# EAGLE design Adafruit FONA SIM5320 3G Breakout (EAGLE 9.1.0)
COMPANY: ADAFRUIT INDUSTRIES; DRAWN: KTOWN; REV: A
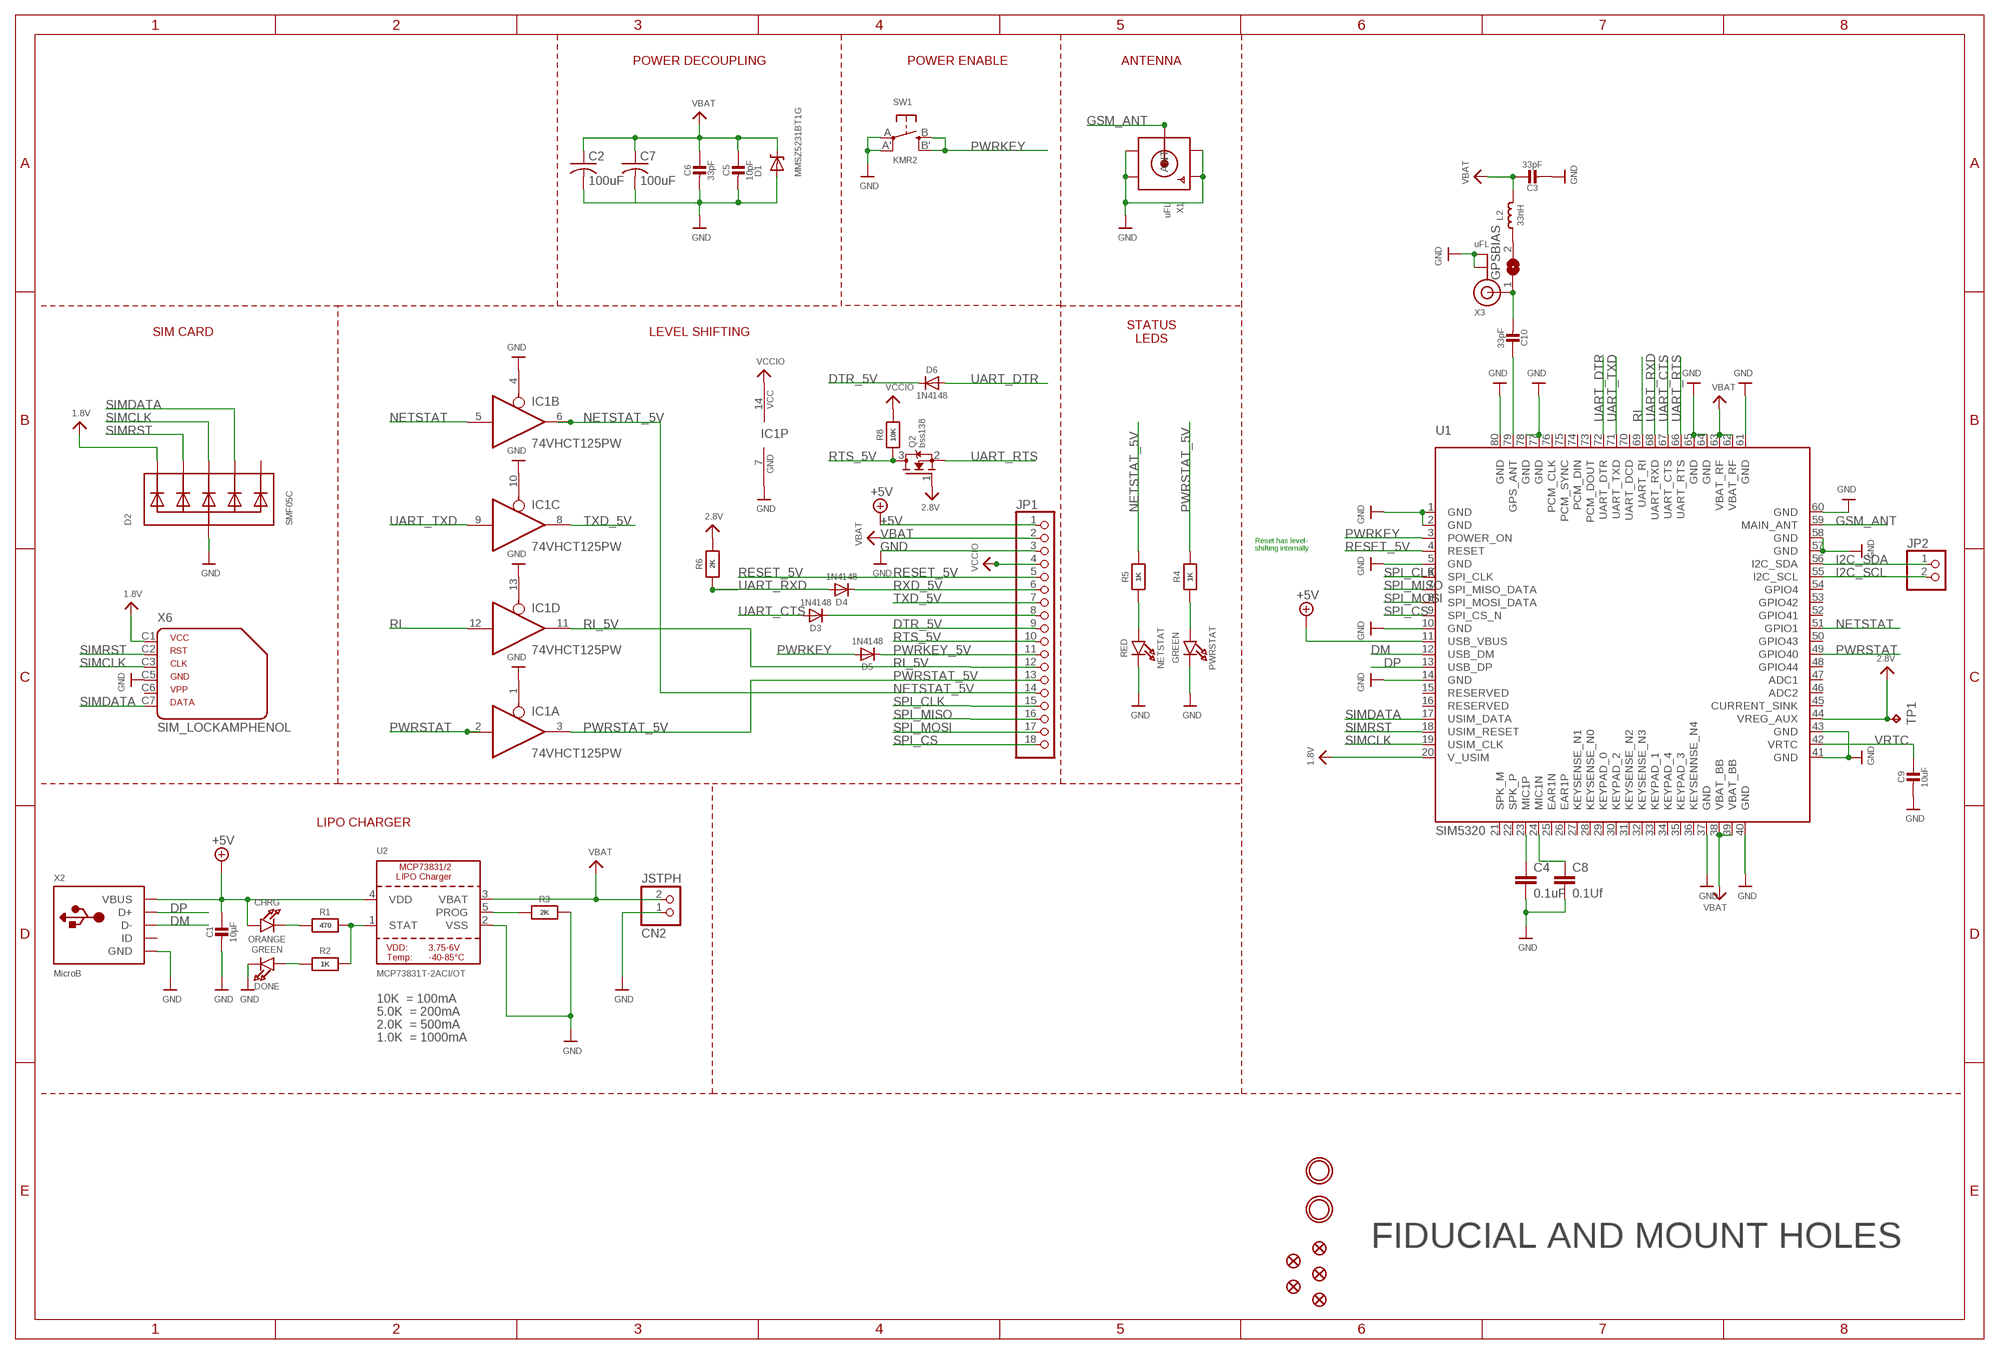
[diagram p0: schematic, sheet 1]

## Parts
C1  10µF  CAP_CERAMIC0805-NOOUTLINE  [0805-NO]
C2  100uF  C-USC1210  [C1210]
C3  33pF  CAP_CERAMIC0805-NOOUTLINE  [0805-NO]
C4  0.1uF  C-EUC1210  [C1210]
C5  10pF  CAP_CERAMIC0805-NOOUTLINE  [0805-NO]
C6  33pF  CAP_CERAMIC0805-NOOUTLINE  [0805-NO]
C7  100uF  C-USC1210  [C1210]
C8  0.1Uf  C-EUC1210  [C1210]
C9  10uF  CAP_CERAMIC0805-NOOUTLINE  [0805-NO]
C10  33pF  CAP_CERAMIC0805-NOOUTLINE  [0805-NO]
CHRG  ORANGE  LED0805_NOOUTLINE  [CHIPLED_0805_NOOUTLINE]
CN2  JSTPH  JST_2PIN  [JSTPH2]
D1  MMSZ5231BT1G  DIODE-ZENERSOD123  [SOD-123]
D2  SMF05C  TVSARRAY_5LANE  [SOT363]
D3  1N4148  DIODESOD-323  [SOD-323]
D4  1N4148  DIODESOD-323  [SOD-323]
D5  1N4148  DIODESOD-323  [SOD-323]
D6  1N4148  DIODESOD-323  [SOD-323]
DONE  GREEN  LED0805_NOOUTLINE  [CHIPLED_0805_NOOUTLINE]
FID1  FIDUCIAL""  [FIDUCIAL_1MM]
FID2  FIDUCIAL""  [FIDUCIAL_1MM]
FID3  FIDUCIAL""  [FIDUCIAL_1MM]
FID4  FIDUCIAL""  [FIDUCIAL_1MM]
FID5  FIDUCIAL""  [FIDUCIAL_1MM]
GPSBIAS  SOLDERJUMPER  [SOLDERJUMPER_ARROW_NOPASTE]
IC1  74VHCT125PW  74ABT125PW  [TSSOP14]
JP1  HEADER-1X18  [1X18_ROUND70]
JP2  HEADER-1X2ROUND  [1X02_ROUND]
L2  33nH  INDUCTOR_0805MP  [_0805MP]
NETSTAT  RED  LED0805_NOOUTLINE  [CHIPLED_0805_NOOUTLINE]
PWRSTAT  GREEN  LED0805_NOOUTLINE  [CHIPLED_0805_NOOUTLINE]
Q2  bss138  MOSFET-NWIDE  [SOT23-WIDE]
R1  470  RESISTOR0805_NOOUTLINE  [0805-NO]
R2  1K  RESISTOR0805_NOOUTLINE  [0805-NO]
R3  2K  RESISTOR0805_NOOUTLINE  [0805-NO]
R4  1K  RESISTOR0805_NOOUTLINE  [0805-NO]
R5  1K  RESISTOR0805_NOOUTLINE  [0805-NO]
R6  2K  RESISTOR0805_NOOUTLINE  [0805-NO]
R8  10K  RESISTOR0805_NOOUTLINE  [0805-NO]
SW1  KMR2  SWITCH_TACT_SMT4.6X2.8  [BTN_KMR2_4.6X2.8]
TP1  TPTP11R  [TP11R]
U1  SIM5320  GSM_SIM5320_LITERAL  [SIM5320]
U2  MCP73831T-2ACI/OT  MCP73831/2  [SOT23-5]
U$33  MOUNTINGHOLE2.5  [MOUNTINGHOLE_2.5_PLATED]
U$34  MOUNTINGHOLE2.5  [MOUNTINGHOLE_2.5_PLATED]
X1  uFL  SMACONNECTOR_EDGE_UFL  [SMA_EDGELAUNCH_UFL]
X2  MicroB  USBMICRO_20329  [4UCONN_20329]
X3  uFL  ANTENNA_U.FL  [U.FL]
X6  SIM_LOCKAMPHENOL  [C707_10M006_512_2]

## Nets
1.8V: D2.1(C1) U1.20(V_USIM) X6.C1
2.8V: Q2.1(G) R6.2 TP1.TP U1.44(VREG_AUX)
+5V: C1.1 CHRG.A JP1.1 U1.11(USB_VBUS) U2.4(VDD) X2.VBUS
CTS_5V: D3.C JP1.8
DM: U1.12(USB_DM) X2.D-
DP: U1.13(USB_DP) X2.D+
DTR_5V: D6.C JP1.9
GND: C1.2 C2.2 C3.2 C4.2 C5.2 C6.2 C7.2 C8.2 C9.2 CN2.1 D1.A D2.2(A) DONE.C IC1.1(A:OE) IC1.4(B:OE) IC1.7(P:GND) IC1.10(C:OE) IC1.13(D:OE) JP1.3 NETSTAT.C PWRSTAT.C R3.2 SW1.A'(P1) SW1.A(P) U1.1(GND) U1.2(GND) U1.5(GND) U1.10(GND) U1.14(GND) U1.37(GND) U1.40(GND) U1.41(GND) U1.43(GND) U1.57(GND) U1.58(GND) U1.60(GND) U1.61(GND) U1.64(GND) U1.65(GND) U1.77(GND) U1.78(GND) U1.80(GND) U2.2(VSS) X1.GND@1(GND1) X1.GND@2(GND2) X1.GND@3(GND3) X1.GND@4(GND4) X2.BASE@1(GND) X2.BASE@2(GND) X2.GND X2.SPRT@1(GND) X2.SPRT@2(GND) X2.SPRT@3(GND) X2.SPRT@4(GND) X3.1(GND) X3.2(GND) X6.C5
GSM_ANT: U1.59(MAIN_ANT) X1.P(ANT)
I2C_SCL: JP2.2 U1.55(I2C_SCL)
I2C_SDA: JP2.1 U1.56(I2C_SDA)
N$1: CHRG.C R1.1
N$2: R1.2 R2.2 U2.1(STAT)
N$3: C10.2 GPSBIAS.1 X3.3(SIGNAL)
N$4: PWRSTAT.A R4.1
N$5: R3.1 U2.5(PROG)
N$6: DONE.A R2.1
N$7: C10.1 U1.79(GPS_ANT)
N$8: C4.1 U1.23(MIC1P)
N$9: NETSTAT.A R5.1
N$10: C8.1 U1.24(MIC1N)
N$31: GPSBIAS.2 L2.1
NETSTAT: IC1.5(B:I) U1.51(GPIO1)
NETSTAT_5V: IC1.6(B:O) JP1.14 R5.2
PWRKEY: D5.A SW1.B'(S1) SW1.B(S) U1.3(POWER_ON)
PWRKEY_5V: D5.C JP1.11
PWRSTAT: IC1.2(A:I) U1.49(GPIO40)
PWRSTAT_5V: IC1.3(A:O) JP1.13 R4.2
RESET_5V: JP1.5 U1.4(RESET)
RI: IC1.12(D:I) U1.69(UART_RI)
RI_5V: IC1.11(D:O) JP1.12
RTS_5V: JP1.10 Q2.3(D) R8.1
RXD_5V: D4.C JP1.6
SIMCLK: D2.4(C3) U1.19(USIM_CLK) X6.C3
SIMDATA: D2.5(C4) U1.17(USIM_DATA) X6.C7
SIMRST: D2.3(C2) U1.18(USIM_RESET) X6.C2
SPI_CLK: JP1.15 U1.6(SPI_CLK)
SPI_CS: JP1.18 U1.9(SPI_CS_N)
SPI_MISO: JP1.16 U1.7(SPI_MISO_DATA)
SPI_MOSI: JP1.17 U1.8(SPI_MOSI_DATA)
TXD_5V: IC1.8(C:O) JP1.7
UART_CTS: D3.A U1.67(UART_CTS)
UART_DTR: D6.A U1.72(UART_DTR)
UART_RTS: Q2.2(S) U1.66(UART_RTS)
UART_RXD: D4.A R6.1 U1.68(UART_RXD)
UART_TXD: IC1.9(C:I) U1.71(UART_TXD)
VBAT: C2.1 C3.1 C5.1 C6.1 C7.1 CN2.2 D1.C JP1.2 L2.2 U1.38(VBAT_BB) U1.39(VBAT_BB) U1.62(VBAT_RF) U1.63(VBAT_RF) U2.3(VBAT)
VCCIO: IC1.14(P:VCC) JP1.4 R8.2
VRTC: C9.1 U1.42(VRTC)
Unconnected: D2.6(C5) U1.15(RESERVED) U1.16(RESERVED) U1.21(SPK_M) U1.22(SPK_P) U1.25(EAR1N) U1.26(EAR1P) U1.27(KEYSENSE_N1) U1.28(KEYSENSE_N0) U1.29(KEYPAD_0) U1.30(KEYPAD_2) U1.31(KEYSENSE_N2) U1.32(KEYSENSE_N3) U1.33(KEYPAD_1) U1.34(KEYPAD_4) U1.35(KEYPAD_3) U1.36(KEYSENNSE_N4) U1.45(CURRENT_SINK) U1.46(ADC2) U1.47(ADC1) U1.48(GPIO44) U1.50(GPIO43) U1.52(GPIO41) U1.53(GPIO42) U1.54(GPIO4) U1.70(UART_DCD) U1.73(PCM_DOUT) U1.74(PCM_DIN) U1.75(PCM_SYNC) U1.76(PCM_CLK) X2.ID X6.C6

## Notes on the sheet
- POWER DECOUPLING | POWER ENABLE | ANTENNA
- SIM CARD | LEVEL SHIFTING
- STATUS
  LEDS
- Reset has level-
  shifting internally
- LIPO CHARGER
- 10K  = 100mA
- 5.0K  = 200mA
- 2.0K  = 500mA
- 1.0K  = 1000mA
- FIDUCIAL AND MOUNT HOLES

## Library data of the parts
C1 C3 C5 C6 C9 C10 = microbuilder:CAP_CERAMIC: Ceramic Capacitors For new designs, use the packages preceded by an '_' character since they are more reliable: The following footprints should be used on most boards: _0402 - Standard footprint for regular board layouts _0603 - Standard footprint for regular board layouts _0805 - Standard footprint for regular board layouts _1206 - Standard footprint for regular board layouts For extremely tight-pitch boards where space is at a premium, the following 'micro-pitch' footprints can be used (smaller pads, no silkscreen outline, etc.): _0402MP - Micro-pitch footprint for very dense/compact boards _0603MP - Micro-pitch footprint for very dense/compact boards _0805MP - Micro-pitch footprint for very dense/compact boards _1206MP - Micro-pitch footprint for very dense/compact boards
C2 C7 = rcl:C-US: CAPACITOR, American symbol
C4 C8 = rcl:C-EU: CAPACITOR, European symbol; SPICEPREFIX: C
CHRG DONE NETSTAT PWRSTAT = microbuilder:LED: LED 0603 - 0603 Surface Mount Package 2mA: Green LED - Low Power (3.9mcd, 2ma, 1.7Vf) - Digikey: 475-2709-2-ND Orange LED - Low Power (9.8mcd, 2ma, 1.8Vf) - Digikey: 475-1194-2-ND Red LED - Low Power (5mcd, 2ma, 1.8Vf) - Digikey: 475-1195-2-ND Yellow LED - Low Power (7mcd, 2ma, 1.8Vf) - Digikey: 475-1196-2-ND 5mA: Blue LED - Low Power (17mcd, 5ma, 2.9Vf) - Digikey: LNJ937W8CRACT-ND 0805 - 0805 Surface Mount Package 2mA: Red LED (8.8mcd, 2mA, 1.8Vf, Clear) - Low Power [Digikey: 475-2510-1-ND] Green LED (5mcd, 2mA, 1.8Vf, Clear) - Low Power [Digikey: 475-2730-1-ND] Yellow LED (11.3mcd, 2mA, 1.8Vf, Clear) - Low Power [Digikey: 475-2555-1-ND] 20mA: Red LED (104mcd, 20mA, Diffused) - LS R976 [Digikey: 475-1278-6-ND] Red LED (12mcd, 20mA, 2.0Vf, Clear) - APT2012EC [Digikey: 754-1128-1-ND] Green LED (15mcd, 20mA, 2.2Vf, Clear) - APT2012GC [Digikey: 754-1131-1-ND] Orange LED (160mcd, 20mA, 2.1Vf, Clear) - APT2012SECK [Digikey: 754-1130-1-ND] 1206 - 1206 Surface Mount Package Green LED (26mcd, 20mA, Diffused) - LG N971 [Digikey: 475-1407-6-ND] Red LED (15mcd, 20mA, Diffused) - LH N974 [Digikey: 475-1416-6-ND] Cree - Cree High-Power Surface Mount LEDs XPEBWT-L1-0000-00D50 - White 111lm 350mA 2.9Vf 6200K 110° XTEAWT-00-0000-00000LEE3 - White 114lm 350mA 2.85Vf 5000K 115° Everlight - Everlight 45-21 Series Surface Mount LEDs 45-21/QK2C-B2832AC2CB2/2T - Warm White 2000mcd 20mA 3.25Vf 3050K 120° 45-21/LK2C-B38452C4CB2/2T - Nuetral White 2000mcd 20mA 3.25Vf 4150K 120° 45-21/LK2C-B50634C6CB2/2T - Cold White 2200mcd 20mA 3.25Vf 5650K 120° PLCC2 Reverse Mount LS T77K-J1L2-1-0-2-R18-Z - Red 11.25mcd 2mA 1.8Vf 630nm 120° LO T77K-L1M2-24-Z - Orange 19.6mcd 2mA 1.8Vf 606nm 120° LY T77K-K2M1-26-Z - Yellow 15.7mcd 2mA 1.8Vf 587nm 120°
CN2 = microbuilder:JST_2PIN: JST 2-Pin Right-Angle Connector PH-Series - 4UConnector: 17311 SH-Series - 4UConnector: 07278
D1 = microbuilder:DIODE-ZENER: Zener Diode SMA: 30V 1W Zener Diode, 1.2Vf - Digikey: SMAZ30-FDICT-ND
D2 = microbuilder:TVSARRAY_5LANE: Voltage Transient Suppressor Array SOT363 SMF05C - 100W 5V: Digikey - SMF05CT1GOSCT-ND
D3-D6 = microbuilder:DIODE: Diode SMA Model Volts Amps Type Vf Ir Digikey # Notes SSA34-E3 40V 3A Schottky 480mV @ 3A 200uA @ 40V SSA34-E3/61TGITR-ND CDBA120-G 20V 1A Schottky 500mV @ 1A 500uA @ 20V 641-1014-6-ND REEL MBRA210 10V 2A Schottky 350mV @ 2A 700uA @ 10V MBRA210LT3 SOD-123 Model Volts Amps Type Vf Ir Order # Notes BAT54T1G 30V 200mA Schottky 800mV @ 200mA 2uA @ 25V BAT54T1GOSTR-ND B0530W 30V 500mA Schottky 430mV @ 500mA 130uA @ 30V B0530W-FDICT-ND REEL MBR120 20V 1A Schottky 340mV @ 1A MBR120VLSFT1GOSCT-ND SOD-323 Model Volts Amps Type Vf Ir Order # Notes PMEG2005EJ 20V 500mA Schottky 355mV @ 500mA 568-4110-1-ND ZLLS410 10V 570mA Schottky 380mV @ 570mA ZLLS410CT-ND 1N4148WS 75V 150mA Silicon/Simple 1V 1N4148WSFSCT-ND REEL SOD-523 Model Volts Amps Type Vf Ir Order # Notes BAT54XV2 30V 200mA Schottky 0.8V @ 100mA BAT54XV2CT-ND TB751S 30V 30mA Schottky RB751S-40TE61CT-ND SOT23-R/W (R = Solder Paste/Reflow Ovens, W = Hand-Soldering) Model Volts Amps Type Vf Ir Order # Notes BAT54FILM 40V 300mA Schottky 497-7162-1-ND POWERDI-5 Model Volts Amps Type Vf Ir Order # Notes PDS560 60V 5A Schottky 670mV @ 5A 150uA @ 60V PDS560DICT-ND
FID1-FID5 = microbuilder:FIDUCIAL: Fiducial Alignment Points Various fiducial points for machine vision alignment.; BOM: EXCLUDE
GPSBIAS = microbuilder:SOLDERJUMPER: SMD Solder JUMPER Solder the two pads together to create a connection, or remove the solder to break it. REFLOW - Use this footprint for solder paste and reflow ovens. WAVE - Use this footprint for hand-soldering (larger pads). CLOSED - Has a trace between the two pads to ensure it is closed by default. The trace needs to be cut to disable the jumper, and can be closed again by creating a solder bridge between the two pads.; BOM: EXCLUDE
IC1 = 74xx-us:74*125: Quad bus BUFFER, 3-state
JP1 = microbuilder:HEADER-1X18: Header 1x18
JP2 = microbuilder:HEADER-1X2: PIN HEADER
L2 = microbuilder:INDUCTOR: Inductors 0603: 10nH Ceramic Inductor - microwire antenna/RF (Digikey: 712-1434-2-ND) 0805: 560nH Ceramic Inductor - RF (Digikey: 553-1047-1-ND) 270nH Ceramic Inductor - Q = 40@250MHz, +-5%, 1 Ohm DC Resistance (Digikey: 535-10506-2-ND) 1007 (2518 Metric) SMT: 10µH 10% 250mOhm 820mA 1007 Inductor (Digikey: 587-2189-1-ND) 22µH 10% 500mOhm 580mA 1007 Inductor (Digikey: 587-2190-1-ND) 47µH 10% 950mOhm 420mA 1007 Inductor (Digikey: 587-2191-1-ND) 47µH 5% 100mOhm 1A 1008 Inductor (Digikey: 732-1816-1-ND) 5.0x5.0mm (Taiyo Yuden NR5040 Series) 6.8µH 20% 2.3A 64mOhm Inductor (Digikey: 587-2374-2-ND) 5.0x5.0mm (TDK VLC5045 Series) 4.7µH 20% 3.3A 34mOhm Inductor (Digikey: 445-6526-1-ND) 6.8µH 20% 2.7A 46mOhm Inductor (Digikey: 445-6527-1-ND) 6.0x6.0mm (TDK VLC6045 Series) 4.7µH 20% 3.8A 27mOhm Inductor (Digikey: 445-6538-2-ND) 6.8µH 20% 3A 41mOhm Inductor (Digikey: 445-6540-1-ND) 6.2µH 30% 2.2A 45mOhm Inductor (Digikey: SRR5028-6R2YCT-ND) - Not TDK VLC6045 but footprint should match 6.0x6.0mm (TDK SLF6045 Series) 6.8uH 30% 2A 33mOhm Inductor (Digikey: 445-4572-1-ND, Mouser: 810-SLF645T6R8N2R0PF) 6.0x6.0mm (Sumida CDRH5D28 Series) 6.2uH 30% 1.8A 45mOhm Inductor (Digikey: 308-1542-1-ND) Taiyo Yuden NR3015T2R2M - 2.2uH 20% 1.5A (Digikey: 587-1648-2-ND, Mouser: 963-NR3015T2R2M) - Used with TI TPS62172 CoilCraft RFID Transponder Coil - MA5532-AE (For use with AS3935 Lightning Sensor) Vishay IHLP 1.0uH Molded Inductor - 24mOhm DCR, 5A, +/-20%, -55°C-125°C (Digikey: 541-1319-1-ND)
Q2 = microbuilder:MOSFET-N: N-Channel Mosfet LEGEND VDS: Voltage Drain-Source ID: Drain Current RDS(ON): Drain-Source On-State Resistance VGS(TH): Gate-Source Threshold Voltage CISS: Drain-Source Input Capacitance SOT-23 Name VDS ID RDS(ON) VGS(TH) CISS Order Number 2N7002E 60V 260mA 2.5 Ohm 2.5V @ 250uA 26.7pF @ 25V 2N7002ET1GOSTR-ND BSH103 30V 850mA 400 mOhm 400mV @ 1mA 83pF @ 24V BSH103,235-ND BSS138 60V 320mA 1.6 Ohm 1.5V @ 250uA 50pF @ 10V Mouser: 771-BSS138PW115 DMN2075U-7 20V 4.2A 38 mOhm 1V @ 250 uA 594.3pF @ 10V DMN2075U-7DICT-ND * BSS138 good choice for I2C level-shifting POWERPAK 1212-8 Name VDS ID RDS(ON) VGS(TH) CISS Order Number Si7308DN 60V 6A 58 mOhm 3V @ 250uA 665pF @ 15V SI7308DN-T1-E3CT-ND
R1-R6 R8 = microbuilder:RESISTOR: Resistors For new designs, use the packages preceded by an '_' character since they are more reliable: The following footprints should be used on most boards: _0402 - Standard footprint for regular board layouts _0603 - Standard footprint for regular board layouts _0805 - Standard footprint for regular board layouts _1206 - Standard footprint for regular board layouts For extremely tight-pitch boards where space is at a premium, the following 'micro-pitch' footprints can be used (smaller pads, no silkscreen outline, etc.): _0402MP - Micro-pitch footprint for very dense/compact boards _0603MP - Micro-pitch footprint for very dense/compact boards _0805MP - Micro-pitch footprint for very dense/compact boards _1206MP - Micro-pitch footprint for very dense/compact boards
SW1 = microbuilder:SWITCH_TACT_SMT: SMT Tact Switches 6x6mm - Digikey: P12940SCT-ND KMR2 (4.6x2.8mm) - Digikey: 401-1426-1-ND EVQ-PQHB55 - Light Touch, 160GF (4.5x4.5mm) - Digikey: P8090SCT-ND KMT0 - KMT021 NGJ LHS (etc.) IP68/Waterproof - Digikey: CKN10289CT-ND
TP1 = testpad:TP: Test pad
U1 = microbuilder:GSM_SIM5320_LITERAL
U2 = microbuilder:MCP73831/2: MCP73831/2 LIPO Charger VDD: 3.75 - 6V Temp -40 - 85°C Programmable Charge Rate: 15-500mA NOTE: STAT is a tri-state logic output on the MCP73831 and an open-drain output on the MCP73832. SOT23-5 with 4.2V output and tri-state logic on STAT = MCP73831T-2ACI/OT
U$33 U$34 = microbuilder:MOUNTINGHOLE: Mounting Hole For #2 screws (0.086"/2.18mm width, 0.094"/2.4mm hole) use 2.5mm; BOM: EXCLUDE
X1 = microbuilder:SMACONNECTOR: SMA Connector 90° DIP SMA Connector, 50 Ohm (4UConnector: 07259)
X2 = microbuilder:USB: USB Connectors USBMINIB - Surface Mount Female Mini-B USB Connector 4UConnector: 06564
X3 = microbuilder:ANTENNA_U.FL: U.FL Antenna Connector
X6 = microbuilder:SIM_LOCK: C707A SIMLOCK® 2.5 mm with wide solder tails Source: Data sheet <http://www.amphenol.info/downloads/C707_10M006_512_2.pdf>; OC_FARNELL: unknown; OC_NEWARK: unknown

## Board
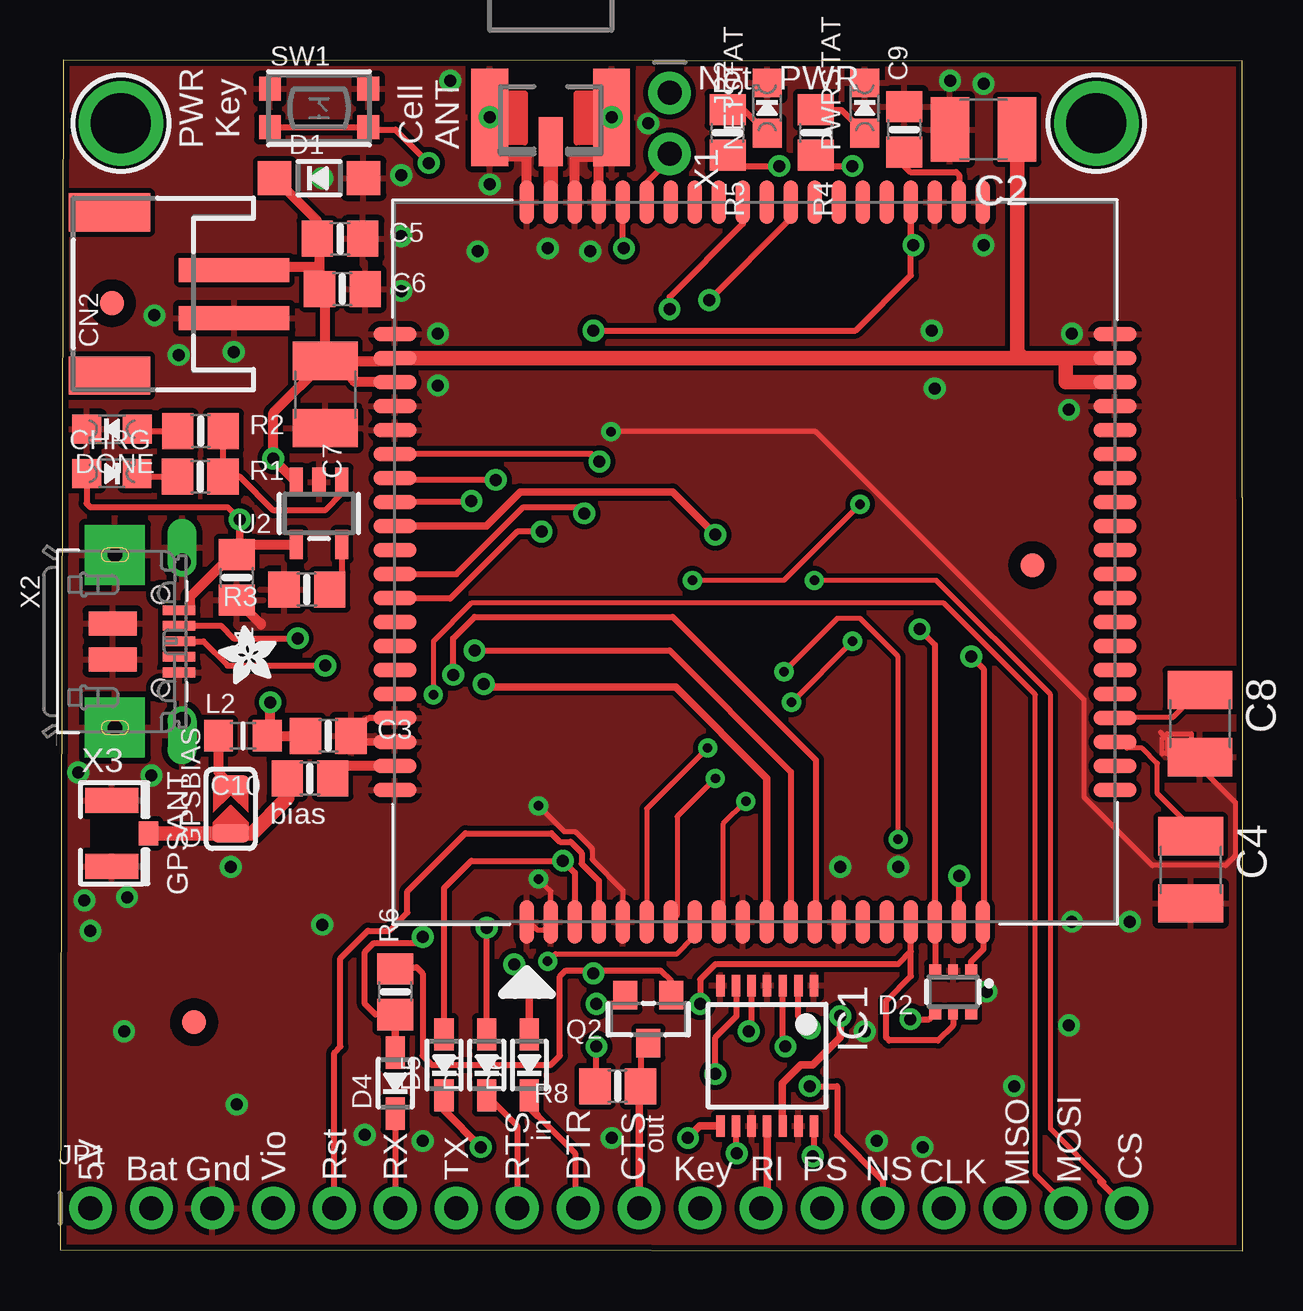
[diagram p1: board, top side]
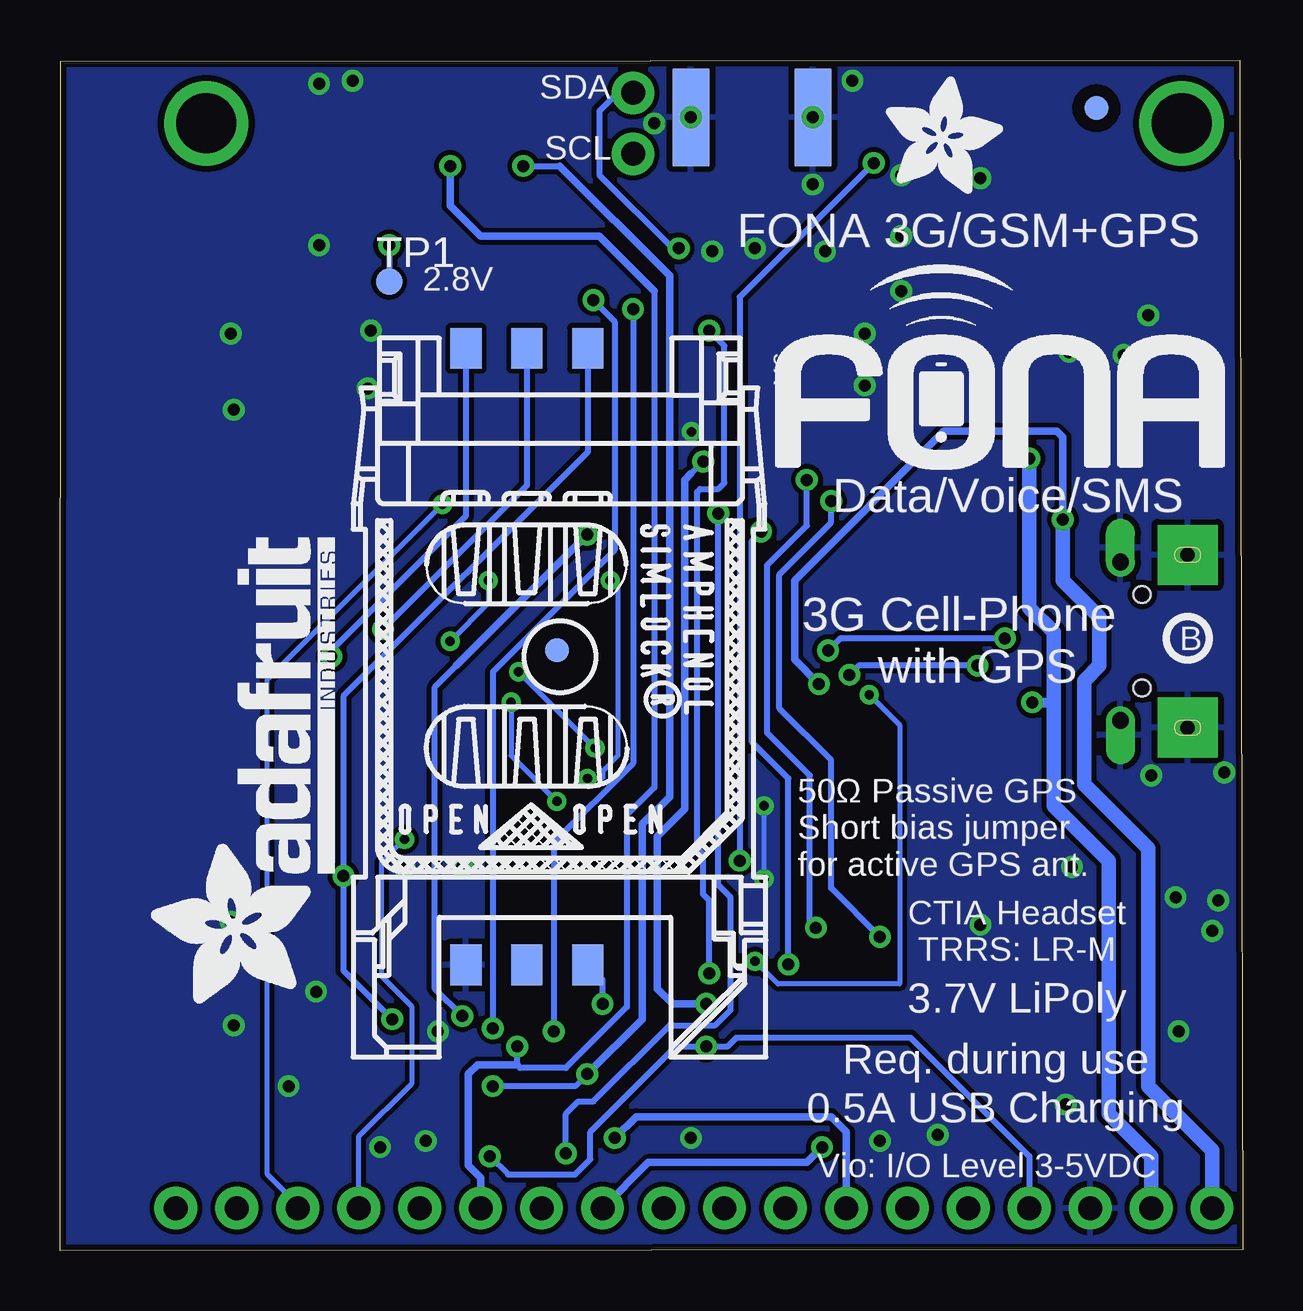
[diagram p2: board, bottom side, seen from below]

Size 49.28 x 49.63 mm. Coordinates in mm from the lower left corner, seen from the top.
Outline: 0.13,49.63 0,0.04 49.28,0 49.28,31.24 49.28,31.37 49.25,31.39 49.25,49.59 0.13,49.63
Copper layers (1*16): Top 0.035mm / dielectric 1.5mm / Bottom 0.035mm
Design rules "adafruit *": minimum track width 8mil, minimum drill 15.5mil, track to track 8mil, track to pad 8mil, pad to pad 8mil, via to via 8mil, smd to smd 8mil, copper to edge 10mil, drill to drill 8mil, minimum pad ring 10mil, minimum via ring 8mil, stop-mask expansion 2mil, vias tented up to drill 20mil, thermal gap 10mil
tRestrict: area 13.7,34.7 to 14.2,34.8; area 13.7,21.6 to 14.2,21.7; area 19.9,13.5 to 20.1,14; area 21.8,43.4 to 22,43.9

### Footprints (pad centres in the part's own frame; a part is rotated, then mirrored left to right if it is on the bottom)
0805-NO = smd 1.3 x 1.5: 1 -0.95,0; 2 0.95,0
C1210 = smd 1.6 x 2.7: 1 -1.4,0; 2 1.4,0
CHIPLED_0805_NOOUTLINE = smd 1.2 x 1.2: A 0,-1.05; C 0,1.05
JSTPH2 = smd 1 x 4.6: 1 -1,-3.7; 2 1,-3.7 | smd 1.6 x 3.4: NC1 -3.4,1.5; NC2 3.4,1.5
SOD-123 = smd 1.4 x 1.4: A 1.85,0; C -1.85,0
SOT363 = smd 0.5 x 0.5: 1 -0.75,-0.9; 3 0.75,-0.9; 4 0.75,0.9; 6 -0.75,0.9 | smd 0.4 x 0.5: 2 0,-0.9; 5 0,0.9
SOD-323 = smd 1.35 x 0.8: A 1.27,0; C -1.27,0
FIDUCIAL_1MM = smd 1 x 1: 1 0,0
SOLDERJUMPER_ARROW_NOPASTE = smd 0.762 x 1.524: 1 -1.016,0; 2 1.016,0
TSSOP14 = smd 0.35 x 0.9: 1 -1.95,-2.925; 2 -1.3,-2.925; 3 -0.65,-2.925; 4 0,-2.925; 5 0.65,-2.925; 6 1.3,-2.925; 7 1.95,-2.925; 8 1.95,2.925; 9 1.3,2.925; 10 0.65,2.925; 11 0,2.925; 12 -0.65,2.925; 13 -1.3,2.925; 14 -1.95,2.925
1X18_ROUND70 = drill 1 pad 1.778: 1 -21.59,0; 2 -19.05,0; 3 -16.51,0; 4 -13.97,0; 5 -11.43,0; 6 -8.89,0; 7 -6.35,0; 8 -3.81,0; 9 -1.27,0; 10 1.27,0; 11 3.81,0; 12 6.35,0; 13 8.89,0; 14 11.43,0; 15 13.97,0; 16 16.51,0; 17 19.05,0; 18 21.59,0
1X02_ROUND = drill 1 pad 1.778: 1 -1.27,0; 2 1.27,0
_0805MP = smd 1.2 x 1.3: 1 -1.016,0; 2 1.016,0
SOT23-WIDE = smd 1 x 1.2: 1 -0.95,-1; 2 0.95,-1; 3 0,1
BTN_KMR2_4.6X2.8 = smd 0.9 x 1: A 2.05,0.8; A' -2.05,0.8; B 2.05,-0.8; B' -2.05,-0.8
TP11R = smd 1.1 x 1.1: TP 0,0
SIM5320 = smd 1.8 x 0.6: 1 -15,9.5; 2 -15,8.5; 3 -15,7.5; 4 -15,6.5; 5 -15,5.5; 6 -15,4.5; 7 -15,3.5; 8 -15,2.5; 9 -15,1.5; 10 -15,0.5; 11 -15,-0.5; 12 -15,-1.5; 13 -15,-2.5; 14 -15,-3.5; 15 -15,-4.5; 16 -15,-5.5; 17 -15,-6.5; 18 -15,-7.5; 19 -15,-8.5; 20 -15,-9.5; 41 15,-9.5; 42 15,-8.5; 43 15,-7.5; 44 15,-6.5; 45 15,-5.5; 46 15,-4.5; 47 15,-3.5; 48 15,-2.5; 49 15,-1.5; 50 15,-0.5; 51 15,0.5; 52 15,1.5; 53 15,2.5; 54 15,3.5; 55 15,4.5; 56 15,5.5; 57 15,6.5; 58 15,7.5; 59 15,8.5; 60 15,9.5 | smd 0.6 x 1.8: 21 -9.5,-15; 22 -8.5,-15; 23 -7.5,-15; 24 -6.5,-15; 25 -5.5,-15; 26 -4.5,-15; 27 -3.5,-15; 28 -2.5,-15; 29 -1.5,-15; 30 -0.5,-15; 31 0.5,-15; 32 1.5,-15; 33 2.5,-15; 34 3.5,-15; 35 4.5,-15; 36 5.5,-15; 37 6.5,-15; 38 7.5,-15; 39 8.5,-15; 40 9.5,-15; 61 9.5,15; 62 8.5,15; 63 7.5,15; 64 6.5,15; 65 5.5,15; 66 4.5,15; 67 3.5,15; 68 2.5,15; 69 1.5,15; 70 0.5,15; 71 -0.5,15; 72 -1.5,15; 73 -2.5,15; 74 -3.5,15; 75 -4.5,15; 76 -5.5,15; 77 -6.5,15; 78 -7.5,15; 79 -8.5,15; 80 -9.5,15
SOT23-5 = smd 0.55 x 1.2: 1 -0.95,-1.3; 2 0,-1.3; 3 0.95,-1.3; 4 0.95,1.3; 5 -0.95,1.3
MOUNTINGHOLE_2.5_PLATED = drill 2.5 pad 3.2: P$1 0,0
SMA_EDGELAUNCH_UFL = smd 4.064 x 1.524: GND@1 2.032,-2.54; GND@2 2.032,2.54 | smd 4.064 x 1.524 bottom: GND@3 2.032,2.54; GND@4 2.032,-2.54 | smd 2.032 x 1.016: P 3.048,0
4UCONN_20329 = smd 1 x 2: BASE@1 -0.75,-2; BASE@2 0.75,-2 | smd 0.4 x 1.35: D+ 0,0.775; D- -0.65,0.775; GND 1.3,0.775; ID 0.65,0.775; VBUS -1.3,0.775 | drill 0.7 offset: SPRT@1 -3.3,0.9; SPRT@2 3.3,0.9 | drill 0.6 pad 2.5 square: SPRT@3 -3.6,-1.9; SPRT@4 3.6,-1.9 | hole 0.7: -1.95,0; 1.95,0
U.FL = smd 2.2 x 1.05: 1 0,1.375; 2 0,-1.375 | smd 0.8 x 1: 3 1.525,0
C707_10M006_512_2 = smd 1.7 x 1.3: C1 -12.85,-3.915; C2 -12.85,-1.375; C3 -12.85,1.165; C5 12.85,-3.915; C6 12.85,-1.375; C7 12.85,1.165

### Placement (x,y rotation side)
C1  7.37,28.07 270 top
C2  38.48,46.74 180 top
C3  11.18,21.46 0 top
C4  47.12,15.88 270 top
C5  11.67,42.18 0 top
C6  11.76,40.08 0 top
C7  11.05,35.69 270 top
C8  47.5,21.97 270 top
C9  35.18,46.74 90 top
C10  10.41,19.68 180 top
CHRG  2.16,32.4 270 top
CN2  3.56,39.88 90 top
D1  10.79,44.7 0 top
D2  37.21,10.79 180 top
D3  17.78,7.75 90 top
D4  13.97,6.99 90 top
D5  16,7.75 90 top
D6  19.56,7.75 90 top
DONE  2.17,34.24 90 top
FID1  40.51,28.57 0 top
FID2  2.16,39.5 0 top
FID3  5.59,9.53 0 top
FID4  6.1,47.62 0 bottom
FID5  28.57,25.02 0 bottom
GPSBIAS  7.11,18.41 90 top
IC1  29.46,8.13 180 top
JP1  22.86,1.78 0 top
JP2  25.4,46.99 270 top
L2  7.62,21.46 0 top
NETSTAT  29.46,47.62 0 top
PWRSTAT  33.53,47.62 0 top
Q2  24.51,9.65 180 top
R1  5.84,32.26 0 top
R2  5.86,34.16 0 top
R3  10.29,27.56 180 top
R4  31.5,46.61 270 top
R5  27.81,46.61 270 top
R6  13.97,10.79 90 top
R8  23.24,6.86 180 top
SW1  10.79,47.62 0 top
TP1  35.56,40.39 0 bottom
U1  28.96,28.7 90 top
U2  10.79,30.73 180 top
U$21  [ADAFRUIT_2.5MM]  9.02,23.62 90 top
U$25  [PCBFEAT-REV-040]  2.29,25.53 0 bottom
U$26  [FONA_LOGO]  19.94,32.38 0 bottom
U$33  43.18,46.99 90 top
U$34  2.54,46.99 90 top
U$36  [ADAFRUIT_5MM]  14.86,44.07 0 bottom
U$42  [ADAFRUIT_TEXT_20MM]  37.85,10.16 90 bottom
X1  20.45,49.28 270 top
X2  4.19,25.4 270 top
X3  2.16,17.4 0 top
X6  28.45,24.77 270 bottom

### Tracks (layer width: path | path; a pad name or v marks a point on that pad's centre or on a via)
1.8V  (via drill 0.5)
  Top 0.254: D2.1 37.96,12.05 38.48,12.57 38.48,13.68 | 38.48,13.68 U1.20 | v37.97,24.77 38.48,24.26 38.48,13.68
  Bottom 0.254: X6.C1 32.36,30.63 37.97,25.02 v37.97,24.77
2.8V  (via drill 0.5)
  Top 0.254: v35.56,41.91 35.46,42.01 U1.44 35.46,40.66 33.15,38.35 v22.23,38.35 | 22.23,11.68 21.08,11.68 20.83,11.43 20.83,8.13 20.45,7.75 15.49,7.75 15.11,8.13 15.11,11.56 14.86,11.81 14.04,11.81 R6.2 | 22.23,11.68 25.02,11.68 25.46,11.24 Q2.1 | 22.23,11.68 v22.23,11.56
  Bottom 0.254: v35.56,41.91 TP1.TP | v22.23,11.56 22.23,14.61 22.48,14.86 22.48,16.51 22.73,16.76 22.73,31.62 22.61,31.75 21.84,31.75 21.59,32 21.59,37.72 v22.23,38.35
+5V  (via drill 0.5)
  Top 0.254: CHRG.A 1.11,31.15 1.27,30.99 6.99,30.99 v7.49,30.48
  Top 0.305: U1.11 29.46,19.69 25.65,23.5 17.78,23.5 v17.65,23.62 | 7.59,29.43 7.49,29.53 v7.49,30.48
  Top 0.406: X2.VBUS 5.42,26.7 5.42,27.27 7.37,29.21 | 7.37,29.21 C1.1 | 7.37,29.21 7.59,29.43 U2.4
  Bottom 0.305: v17.65,23.62 18.67,24.64 18.67,27.94 12.45,34.16 7.75,34.16 7.49,33.91 v7.49,30.48 7.49,29.72
  Bottom 0.61: JP1.1 1.27,4.19 3.94,6.86 3.94,16.76 6.6,19.43 6.6,23.75 5.97,24.38 5.97,26.42 7.49,27.94 v7.49,30.48
CTS_5V
  Top 0.254: D3.C 19.05,5.21 JP1.8
DM  (via drill 0.5)
  Top 0.254: X2.D- 6.72,26.05 7.24,25.53 v9.91,25.53 | v17.27,25.02 25.4,25.02 30.46,19.96 U1.12
  Bottom 0.254: v9.91,25.53 16.76,25.53 v17.27,25.02
DP  (via drill 0.5)
  Top 0.254: X2.D+ 5.97,25.4 6.99,24.38 v11.05,24.38 | v16.38,24 16.38,25.53 17.27,26.42 25.53,26.42 31.5,20.45 31.5,13.74 U1.13
  Bottom 0.254: v11.05,24.38 16,24.38 v16.38,24
DTR_5V
  Top 0.254: 19.88,5.65 21.46,4.06 21.46,1.91 JP1.9
  Top 0.305: D6.C 19.56,5.97 19.88,5.65
GND  (via drill 0.39, 0.5)
  Top 0.203: U1.1 19.55,13.7 19.9,13.36 20.11,13.36 U1.2 20.46,14.98 v19.94,15.49 | U1.5 23.46,15.03 22.17,16.31 22.17,16.76 21.46,17.47 21.01,17.47 v19.94,18.54 | v22.96,34.14 31.5,34.14 42.67,22.96 42.67,18.9 45.52,16.05 48.56,16.05 48.97,16.46 48.97,18.69 47.14,20.52 47.14,21.54 46.13,21.54 45.92,21.34 45.92,20.73 46.13,20.73 46.13,21.34 45.85,21.61
  Top 0.254: U1.77 12.87,22.2 C3.2
  Top 0.305: U1.78 12.13,21.2 C3.2
  Top 0.406: C1.2 8.38,26.1 8.38,26.16 | U1.58 21.46,45.59 22.73,45.59 22.73,47.24 X1.GND@2 | U1.57 22.46,47.12 22.99,47.12 | U1.60 19.46,45.59 18.29,45.59
  Bottom 0.203: v19.94,15.49 v19.94,18.54
  other vias: 38.61,10.79 39.75,6.86 42.04,9.4 34.04,4.57 22.99,4.7 15.11,4.57 12.7,4.83 7.37,6.1 35.94,4.32 33.53,9.14 32.51,16 34.92,16 42.16,13.72 44.58,13.72 2.67,9.14 10.92,13.59 7.11,16 1.27,13.34 17.91,47.24 22.99,47.24 0.76,19.94 2.79,14.73 3.81,19.81 1.02,14.61 17.91,44.45 16.26,48.77 24.51,46.99 22.1,41.66 20.32,41.78 17.4,41.66 14.22,42.29 14.22,40.01 14.22,44.83 10.92,44.7 7.24,37.47 3.94,38.99 4.95,37.34 38.48,48.64 37.08,48.77 38.48,41.91 42.16,38.23 42.04,35.05 36.45,35.94 36.32,38.35 15.75,38.23 15.75,36.07
  pour Top: 0,50.8 0,0 50.55,0 50.55,50.8
  pour Bottom: 0,50.29 0,0 49.4,0 49.4,50.29
GSM_ANT
  Top 0.61: U1.59 20.45,43.71 X1.P
I2C_SCL
  Top 0.254: U1.55 24.46,44.52 25.4,45.47 JP2.2
I2C_SDA  (via drill 0.5)
  Top 0.254: v23.5,41.78 23.46,41.82 U1.56
  Bottom 0.254: JP2.1 26.04,48.26 26.8,47.5 26.8,44.83 23.75,41.78 v23.5,41.78
N$1
  Top 0.254: CHRG.C 3.07,32.26 R1.1
N$2
  Top 0.254: R2.2 6.81,32.27 R1.2 7.49,32.26 8.89,30.86 11.05,30.86 11.74,31.56 U2.1
N$3
  Top 0.61: C10.2 9.46,18.86 8,17.4 GPSBIAS.1 X3.3
N$4
  Top 0.254: R4.1 32.54,47.56 PWRSTAT.A
N$5
  Top 0.254: U2.5 11.74,28.07 R3.1
N$6
  Top 0.254: DONE.A 3.3,34.16 R2.1
N$7
  Top 0.406: U1.79 11.88,20.2 C10.1
N$8
  Top 0.203: U1.23 44.45,20.95 45.09,20.95 45.72,20.32 45.72,19.05 46.99,17.78 C4.1
N$9
  Top 0.254: R5.1 28.48,47.56 NETSTAT.A
N$10
  Top 0.203: U1.24 44.45,22.23 46.35,22.23 46.99,22.86 C8.1
N$31
  Top 0.406: L2.1 6.6,19.94 GPSBIAS.2
NETSTAT  (via drill 0.5)
  Top 0.254: U1.51 28.46,42.81 25.4,39.75 v25.4,39.24 | v28.7,9.14 28.81,9.26 IC1.5
  Bottom 0.254: v25.4,39.24 25.4,20.32 28.7,17.02 v28.7,9.14
NETSTAT_5V  (via drill 0.5)
  Top 0.254: v29.97,45.21 28.26,45.21 R5.2 | v27.3,7.37 27.3,8.89 28.19,9.78 28.19,11.02 IC1.6 | v31.24,6.86 32.38,6.86 32.38,4.83 34.29,2.92 JP1.14
  Bottom 0.254: v29.97,45.21 28.45,45.21 | v31.24,6.86 27.81,6.86 v27.3,7.37
  Bottom 0.305: 28.45,45.21 23.88,40.64 23.88,18.92 25.02,17.78 25.02,9.65 v27.3,7.37
PWRKEY  (via drill 0.5)
  Top 0.254: SW1.B' SW1.B 12.93,46.74 13.97,46.74 v15.37,45.34 | U1.3 21.46,15.76 v20.95,16.26 17.14,16.26 16,15.11 D5.A
  Bottom 0.254: v20.95,16.26 20.95,39.75 v15.37,45.34
PWRKEY_5V  (via drill 0.5)
  Top 0.305: D5.C 16,5.84 v17.53,4.32
  Bottom 0.305: v17.53,4.32 18.16,3.68 24.77,3.68 JP1.11
PWRSTAT  (via drill 0.5)
  Top 0.254: U1.49 30.46,43.03 v27.05,39.62 | v31.24,9.27 30.76,9.75 IC1.2
  Bottom 0.254: v27.05,39.62 26.16,38.73 26.16,29.21 31.24,24.13 v31.24,9.27
PWRSTAT_5V  (via drill 0.5)
  Top 0.254: v33.02,45.21 31.88,45.21 31.88,45.28 R4.2 | v30.23,8.51 30.11,8.4 IC1.3
  Bottom 0.254: v33.02,45.21 33.02,44.83 | 24.51,40.01 24.51,19.3 25.65,18.16 25.65,10.16 28.19,7.62 30.1,7.62 30.23,7.75 v30.23,8.51
  Bottom 0.305: JP1.13 31.75,3.05 32.26,3.56 32.26,7.37 31.88,7.75 30.23,7.75 | 33.02,44.83 33.02,43.56 31.75,42.29 26.8,42.29 24.51,40.01
RESET_5V
  Top 0.254: JP1.5 11.43,8.26 11.68,8.51 11.68,12.19 12.83,13.34 13.72,13.34 14.48,14.1 14.48,14.99 16.89,17.4 20.47,17.4 20.83,17.04 21.28,17.04 21.74,16.58 21.74,16.13 22.46,15.41 U1.4
RI  (via drill 0.5)
  Top 0.305: U1.69 17.76,30.2 19.18,31.62 25.53,31.62 v27.3,29.84 | v32.51,9.78 32.51,8.89 31.37,7.75 30.86,7.75 30.1,6.99 30.1,5.22 IC1.12
  Bottom 0.254: v32.51,9.78 33.66,10.92 33.66,23.5 32.77,24.38
  Bottom 0.305: v27.3,29.84 32.77,24.38
RI_5V
  Top 0.305: IC1.11 29.46,2.54 29.21,2.29 JP1.12
RTS_5V
  Top 0.254: Q2.3 24.19,8.33 R8.1 24.19,6.73 24.13,6.67
  Top 0.305: JP1.10 24.13,6.67
RXD_5V
  Top 0.254: D4.C JP1.6
SIMCLK  (via drill 0.5)
  Top 0.254: U1.19 v37.47,15.62 | v35.43,9.65 36.22,9.65 D2.4
  Bottom 0.254: v35.43,9.65 37.47,11.68 v37.47,15.62 37.47,23.11 27.28,33.3 X6.C3
SIMDATA  (via drill 0.5)
  Top 0.254: D2.5 37.21,9.4 36.58,8.76 34.54,8.76 34.42,8.89 34.42,10.41 35.46,11.45 35.46,12.47 | 35.46,12.47 U1.17 | 35.46,12.47 34.92,11.94 27.3,11.94 26.67,11.3 v26.67,10.29
  Bottom 0.254: v26.67,10.29 26.67,11.3 X6.C7
SIMRST  (via drill 0.5)
  Top 0.254: D2.3 U1.18 36.46,25.27 v35.81,25.91
  Bottom 0.254: X6.C2 29.82,31.9 v35.81,25.91
SPI_CLK  (via drill 0.39)
  Top 0.203: v26.99,20.95 24.45,18.41 24.45,13.97 U1.6 | v30.16,24.13 32.38,26.35 33.34,26.35 34.92,24.77 v34.92,17.14
  Bottom 0.203: v30.16,24.13 v26.99,20.95 | v34.92,17.14 35.88,16.19 35.88,11.43 34.61,10.16 34.61,6.99 36.83,4.76 JP1.15
SPI_CS  (via drill 0.39)
  Top 0.203: v28.57,18.73 27.62,17.78 27.62,13.97 U1.9 | v33.02,25.4 v30.48,22.86 | v31.43,27.94 36.51,27.94 41.27,23.18 41.27,5.08 43.5,2.86 43.43,2.79
  Top 0.254: 43.33,2.9 43.43,2.79 JP1.18
  Bottom 0.203: v28.57,18.73 30.48,20.64 v30.48,22.86 | v33.02,25.4 31.43,26.99 v31.43,27.94
SPI_MISO  (via drill 0.39)
  Top 0.203: v27.3,19.68 25.72,18.1 25.72,13.97 U1.7 | v26.35,27.94 30.16,27.94 v33.34,31.11
  Top 0.254: JP1.16 38.86,2.29
  Bottom 0.203: v27.3,19.68 26.67,19.68 26.67,20 26.04,20.64 26.04,27.62 v26.35,27.94 | v33.34,31.11 40.64,23.81 40.64,3.17 39.37,1.91 JP1.16
SPI_MOSI  (via drill 0.39)
  Top 0.203: v20.32,12.06 20.64,12.38 25.72,12.38 26.35,13.02 26.35,13.65 U1.8 | v15.56,23.18 15.56,25.4 17.14,26.99 36.83,26.99 40.64,23.18 40.64,3.17 41.91,1.91 JP1.17
  Top 0.254: 41.63,2.06 JP1.17
  Bottom 0.203: v20.32,12.06 19.37,11.11 14.29,11.11 14.29,21.91 v15.56,23.18
TXD_5V  (via drill 0.5)
  Top 0.305: IC1.8 26.67,5.2 v26.16,4.7
  Bottom 0.305: v26.16,4.7 25.27,5.59 17.14,5.59 16.51,4.95 JP1.7
UART_CTS  (via drill 0.5)
  Top 0.254: D3.A v17.78,13.46 | v18.16,32.13 14.03,32.13 U1.67
  Bottom 0.254: v17.78,13.46 18.03,13.72 18.03,19.81 19.81,21.59 19.81,28.57 18.16,30.23 v18.16,32.13
UART_DTR  (via drill 0.5)
  Top 0.254: v20.07,29.97 19.05,29.97 16.26,27.18 13.98,27.18 U1.72
  Top 0.305: D6.A 19.56,11.3 v18.92,11.94
  Bottom 0.254: v18.92,11.94 18.92,19.68 20.45,21.21 20.45,29.59 v20.07,29.97
UART_RTS  (via drill 0.5)
  Top 0.254: v22.48,32.89 22.17,33.2 U1.66 | Q2.2 23.2,10.29 v22.35,10.29
  Bottom 0.254: v22.48,32.89 22.99,32.38
  Bottom 0.305: 22.99,32.38 23.24,32.13 23.24,18.41 24.38,17.27 24.38,10.92 23.75,10.29 v22.35,10.29
UART_RXD  (via drill 0.5)
  Top 0.254: v17.14,31.24 17.11,31.2 U1.68 | R6.1 13.14,9.85 12.7,10.29 12.7,12.45 13.08,12.83 14.86,12.83 v15.11,13.08
  Top 0.305: D4.A R6.1 13.52,9.85
  Bottom 0.254: v15.11,13.08 17.14,15.11 17.14,20.45 19.3,22.61 19.3,28.19 17.14,30.35 v17.14,31.24
UART_TXD  (via drill 0.5)
  Top 0.254: U1.71 16.52,28.2 19.3,30.99 21.59,30.99 v21.84,30.73 | IC1.9 28.16,4.09 v28.19,4.06
  Bottom 0.254: v28.19,4.06 28.19,5.71 27.69,6.22 27.05,6.22 23.88,9.4 21.97,9.4 21.34,10.03 21.34,14.73 21.84,15.24 v21.84,30.73 21.97,30.86
VBAT  (via drill 0.5)
  Top 0.254: 7.27,41.02 7.26,41.01 CN2.2
  Top 0.406: C7.1 11.56,37.09 | 11.56,37.09 13.84,37.09 U1.62 | U1.63 12.31,36.2 12.19,36.32 12.19,36.45 11.56,37.09 | C7.1 11.05,39.85 C6.1 10.81,41.02 | 10.81,41.02 10.81,42.08 C5.1 10.72,42.93 D1.C | 7.27,41.02 10.81,41.02 | U2.3 8.89,32.99 v8.89,33.02 8.89,34.93 C7.1 | C3.1 L2.2 8.76,21.46 v8.76,22.86
  Top 0.61: U1.62 40.13,37.2 | 40.13,37.2 41.91,37.2 | 41.91,37.2 U1.39 | U1.38 41.91,36.2 41.91,37.2 | C2.1 39.88,37.45 40.13,37.2
  Bottom 0.406: v8.76,22.86 7.87,22.86 7.87,23.24
  Bottom 0.61: JP1.2 3.81,3.94 5.59,5.71 5.59,16.26 7.87,18.54 7.87,23.24 7.87,25.78 8.89,26.8 v8.89,33.02
VCCIO  (via drill 0.5)
  Top 0.254: v22.35,8.51 22.35,7.37 22.29,7.3 R8.2 | IC1.14 31.41,3.89 v31.37,3.94
  Bottom 0.254: JP1.4 8.89,3.94 13.84,8.89 21.08,8.89 21.46,8.51 v22.35,8.51 23.62,8.51 27.18,4.95 27.18,3.81 27.81,3.17 30.61,3.17 v31.37,3.94
VRTC
  Top 0.254: C9.1 35.18,45.21 35.43,44.96 37.34,44.96 37.47,44.83 U1.42

### Text on the board
tPlace: PWR / Key | Net | PWR | Cell / ANT | bias | GPSANT | MISO | MOSI | in | CS | out | CLK | 5V | Bat | Gnd | Vio | Rst | RX | TX | RTS | DTR | CTS | Key | RI | PS | NS
bPlace: SDA | SCL | FONA 3G/GSM+GPS | 2.8V | Data/Voice/SMS | 3G Cell-Phone | with GPS | 50Ω Passive GPS / Short bias jumper / for active GPS ant. | CTIA Headset / TRRS: LR-M | 3.7V LiPoly | Req. during use | 0.5A USB Charging | Vio: I/O Level 3-5VDC